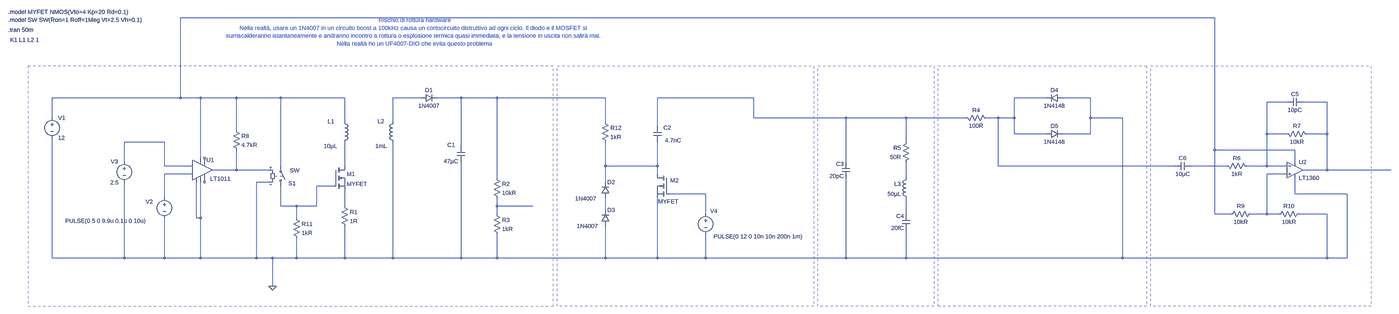
[diagram p0: schematic Eco.asc, whole sheet]
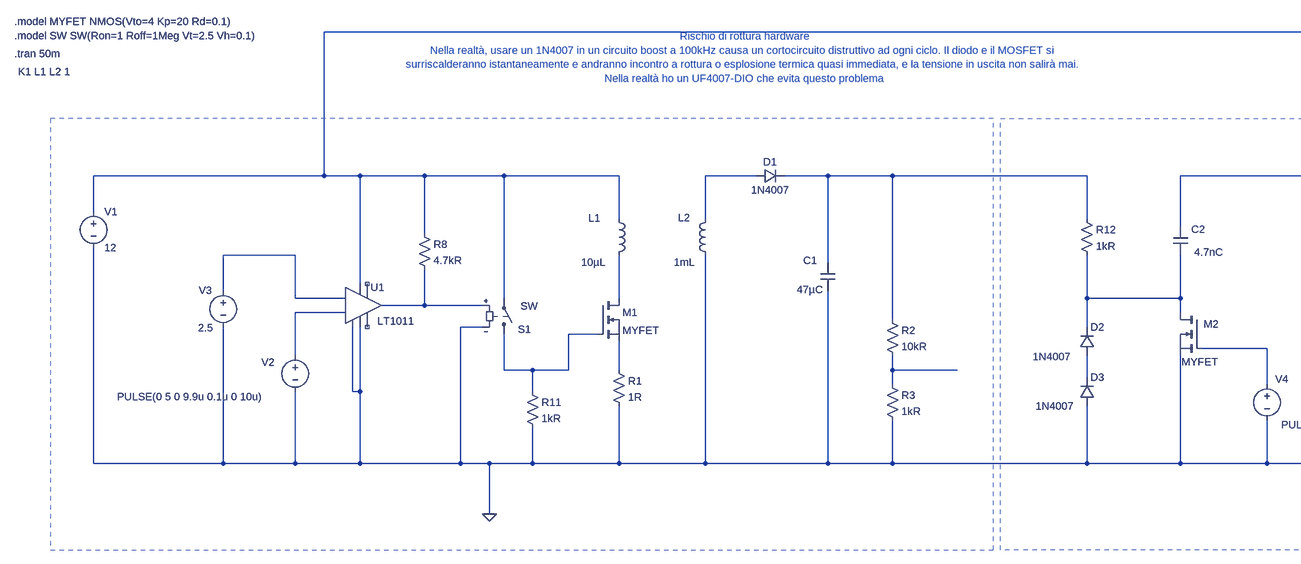
[diagram p1: schematic Eco.asc, part, row 1 of 1, column 1 of 2]
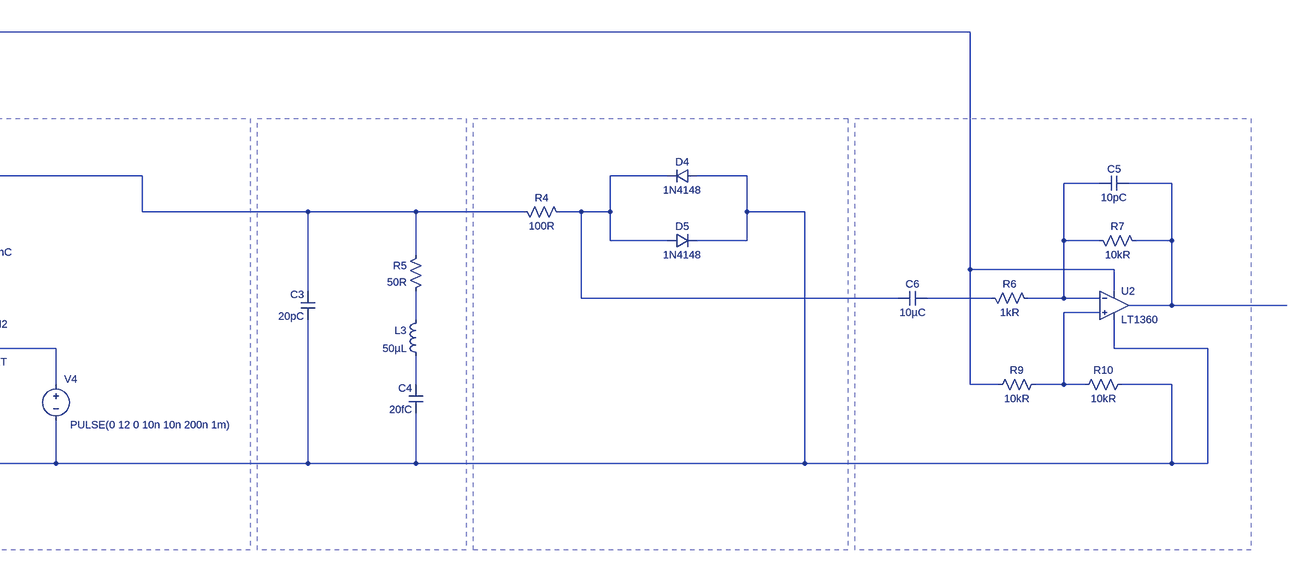
[diagram p2: schematic Eco.asc, part, row 1 of 1, column 2 of 2]
Eco.asc, the LTspice schematic file:
Version 4.1
SHEET 1 5236 1008
WIRE 4160 -816 32 -816
WIRE 32 -496 32 -816
WIRE 32 -496 -480 -496
WIRE 112 -496 32 -496
WIRE 256 -496 112 -496
WIRE 432 -496 256 -496
WIRE 688 -496 432 -496
WIRE 992 -496 880 -496
WIRE 1152 -496 1056 -496
WIRE 1296 -496 1152 -496
WIRE 1728 -496 1296 -496
WIRE 2320 -496 1936 -496
WIRE 3488 -496 3360 -496
WIRE 3664 -496 3552 -496
WIRE 4448 -480 4368 -480
WIRE 4608 -480 4512 -480
WIRE -480 -416 -480 -496
WIRE 2320 -416 2320 -496
WIRE 2688 -416 2320 -416
WIRE 2928 -416 2688 -416
WIRE 3168 -416 2928 -416
WIRE 3296 -416 3248 -416
WIRE 3360 -416 3360 -496
WIRE 3360 -416 3296 -416
WIRE 3664 -416 3664 -496
WIRE 3792 -416 3664 -416
WIRE 688 -400 688 -496
WIRE 880 -400 880 -496
WIRE 1728 -400 1728 -496
WIRE 1936 -384 1936 -496
WIRE 256 -368 256 -496
WIRE 3360 -352 3360 -416
WIRE 3488 -352 3360 -352
WIRE 3664 -352 3664 -416
WIRE 3664 -352 3552 -352
WIRE 4368 -352 4368 -480
WIRE 4448 -352 4368 -352
WIRE 4608 -352 4608 -480
WIRE 4608 -352 4528 -352
WIRE -32 -320 -192 -320
WIRE 2928 -320 2928 -416
WIRE 1152 -304 1152 -496
WIRE 4160 -288 4160 -816
WIRE 4480 -288 4160 -288
WIRE 112 -256 112 -496
WIRE -192 -240 -192 -320
WIRE 2688 -240 2688 -416
WIRE 4480 -240 4480 -288
WIRE -32 -224 -32 -320
WIRE 80 -224 -32 -224
WIRE 432 -224 432 -496
WIRE 688 -224 688 -320
WIRE 1728 -224 1728 -320
WIRE 1936 -224 1936 -320
WIRE 1936 -224 1728 -224
WIRE 3296 -224 3296 -416
WIRE 4000 -224 3296 -224
WIRE 4208 -224 4064 -224
WIRE 4368 -224 4368 -352
WIRE 4368 -224 4288 -224
WIRE 4448 -224 4368 -224
WIRE 256 -208 256 -288
WIRE 256 -208 160 -208
WIRE 384 -208 256 -208
WIRE 4608 -208 4608 -352
WIRE 4608 -208 4512 -208
WIRE 4864 -208 4608 -208
WIRE 80 -192 -32 -192
WIRE 1936 -192 1936 -224
WIRE 4448 -192 4368 -192
WIRE 1296 -176 1296 -496
WIRE 2928 -176 2928 -240
WIRE 384 -160 336 -160
WIRE 1728 -160 1728 -224
WIRE 640 -144 576 -144
WIRE 2128 -112 1984 -112
WIRE 4480 -112 4480 -176
WIRE 4688 -112 4480 -112
WIRE -32 -96 -32 -192
WIRE 432 -64 432 -144
WIRE 496 -64 432 -64
WIRE 576 -64 576 -144
WIRE 576 -64 496 -64
WIRE 688 -64 688 -128
WIRE 1296 -64 1296 -96
WIRE 1440 -64 1296 -64
WIRE 1728 -48 1728 -96
WIRE 1296 -32 1296 -64
WIRE 2128 -32 2128 -112
WIRE 2928 -32 2928 -96
WIRE 4160 -32 4160 -288
WIRE 4224 -32 4160 -32
WIRE 4368 -32 4368 -192
WIRE 4368 -32 4304 -32
WIRE 4416 -32 4368 -32
WIRE 4608 -32 4496 -32
WIRE 96 -16 96 -160
WIRE 112 -16 112 -160
WIRE 112 -16 96 -16
WIRE 496 -16 496 -64
WIRE -480 144 -480 -336
WIRE -192 144 -192 -160
WIRE -192 144 -480 144
WIRE -32 144 -32 -16
WIRE -32 144 -192 144
WIRE 112 144 112 -16
WIRE 112 144 -32 144
WIRE 336 144 336 -160
WIRE 336 144 112 144
WIRE 400 144 336 144
WIRE 496 144 496 64
WIRE 496 144 400 144
WIRE 688 144 688 16
WIRE 688 144 496 144
WIRE 880 144 880 -320
WIRE 880 144 688 144
WIRE 1152 144 1152 -240
WIRE 1152 144 880 144
WIRE 1296 144 1296 48
WIRE 1296 144 1152 144
WIRE 1728 144 1728 16
WIRE 1728 144 1296 144
WIRE 1936 144 1936 -96
WIRE 1936 144 1728 144
WIRE 2128 144 2128 48
WIRE 2128 144 1936 144
WIRE 2688 144 2688 -176
WIRE 2688 144 2128 144
WIRE 2928 144 2928 32
WIRE 2928 144 2688 144
WIRE 3792 144 3792 -416
WIRE 3792 144 2928 144
WIRE 4608 144 4608 -32
WIRE 4608 144 3792 144
WIRE 4688 144 4688 -112
WIRE 4688 144 4608 144
WIRE 400 256 400 144
FLAG 400 256 0
SYMBOL voltage -480 -432 R0
WINDOW 123 0 0 Left 0
WINDOW 39 0 0 Left 0
SYMATTR InstName V1
SYMATTR Value 12
SYMBOL voltage -32 -112 R0
WINDOW 123 0 0 Left 0
WINDOW 39 0 0 Left 0
WINDOW 3 -396 107 Left 2
WINDOW 0 -75 31 Left 2
SYMATTR Value PULSE(0 5 0 9.9u 0.1u 0 10u)
SYMATTR InstName V2
SYMBOL voltage -192 -256 R0
WINDOW 123 0 0 Left 0
WINDOW 39 0 0 Left 0
WINDOW 0 -54 15 Left 2
WINDOW 3 -56 98 Left 2
SYMATTR InstName V3
SYMATTR Value 2.5
SYMBOL Comparators\\LT1011 112 -208 R0
WINDOW 3 39 35 Left 2
SYMATTR InstName U1
SYMBOL nmos 640 -224 R0
SYMATTR InstName M1
SYMATTR Value MYFET
SYMBOL ind 672 -416 R0
WINDOW 0 -52 14 Left 2
WINDOW 3 -68 112 Left 2
SYMATTR InstName L1
SYMATTR Value 10µL
SYMATTR SpiceLine Rser=1m
SYMATTR Type ind
SYMBOL ind 896 -416 M0
WINDOW 0 50 13 Left 2
WINDOW 3 39 112 Left 2
SYMATTR InstName L2
SYMATTR Value 1mL
SYMATTR SpiceLine Rser=1m
SYMATTR Type ind
SYMBOL diode 992 -480 R270
WINDOW 0 32 32 VTop 2
WINDOW 3 0 32 VBottom 2
SYMATTR InstName D1
SYMATTR Value 1N4007
SYMBOL cap 1136 -304 R0
WINDOW 0 -39 -4 Left 2
WINDOW 3 -53 61 Left 2
SYMATTR InstName C1
SYMATTR Value 47µC
SYMBOL res 672 -80 R0
SYMATTR InstName R1
SYMATTR Value 1R
SYMBOL res 1280 -192 R0
SYMATTR InstName R2
SYMATTR Value 10kR
SYMBOL res 1280 -48 R0
SYMATTR InstName R3
SYMATTR Value 1kR
SYMBOL voltage 2128 -48 M0
WINDOW 123 0 0 Left 0
WINDOW 39 0 0 Left 0
WINDOW 3 -390 106 Left 2
WINDOW 0 -48 4 Left 2
SYMATTR Value PULSE(0 12 0 10n 10n 200n 1m)
SYMATTR InstName V4
SYMBOL nmos 1984 -192 M0
WINDOW 0 -37 26 Left 2
WINDOW 3 -36 110 Left 2
SYMATTR InstName M2
SYMATTR Value MYFET
SYMBOL cap 1952 -384 M0
WINDOW 0 -39 7 Left 2
WINDOW 3 -79 58 Left 2
SYMATTR InstName C2
SYMATTR Value 4.7nC
SYMBOL diode 1712 -96 M180
WINDOW 0 24 64 Left 2
WINDOW 3 -105 -2 Left 2
SYMATTR InstName D2
SYMATTR Value 1N4007
SYMBOL diode 1712 16 M180
WINDOW 0 24 64 Left 2
WINDOW 3 -98 0 Left 2
SYMATTR InstName D3
SYMATTR Value 1N4007
SYMBOL diode 3552 -512 R90
WINDOW 0 0 32 VBottom 2
WINDOW 3 32 32 VTop 2
SYMATTR InstName D4
SYMATTR Value 1N4148
SYMBOL diode 3488 -368 M90
WINDOW 0 0 32 VBottom 2
WINDOW 3 32 32 VTop 2
SYMATTR InstName D5
SYMATTR Value 1N4148
SYMBOL res 3152 -432 M90
WINDOW 0 0 56 VBottom 2
WINDOW 3 32 56 VTop 2
SYMATTR InstName R4
SYMATTR Value 100R
SYMBOL cap 2704 -240 M0
SYMATTR InstName C3
SYMATTR Value 20pC
SYMBOL cap 2944 -32 M0
SYMATTR InstName C4
SYMATTR Value 20fC
SYMBOL res 2944 -336 M0
SYMATTR InstName R5
SYMATTR Value 50R
SYMBOL ind 2944 -192 M0
SYMATTR InstName L3
SYMATTR Value 50µL
SYMATTR SpiceLine Rser=1m
SYMBOL res 4304 -208 M270
WINDOW 0 32 56 VTop 2
WINDOW 3 0 56 VBottom 2
SYMATTR InstName R6
SYMATTR Value 1kR
SYMBOL res 4432 -368 M90
WINDOW 0 0 56 VBottom 2
WINDOW 3 32 56 VTop 2
SYMATTR InstName R7
SYMATTR Value 10kR
SYMBOL cap 4448 -496 M90
WINDOW 0 0 32 VBottom 2
WINDOW 3 32 32 VTop 2
SYMATTR InstName C5
SYMATTR Value 10pC
SYMBOL sw 432 -128 M180
WINDOW 0 31 27 Left 2
WINDOW 3 37 78 Left 2
SYMATTR InstName S1
SYMBOL res 240 -384 R0
SYMATTR InstName R8
SYMATTR Value 4.7kR
SYMBOL OpAmps\\LT1360 4480 -208 R0
SYMATTR InstName U2
SYMBOL res 4320 -48 R90
WINDOW 0 0 56 VBottom 2
WINDOW 3 32 56 VTop 2
SYMATTR InstName R9
SYMATTR Value 10kR
SYMBOL res 4512 -48 R90
WINDOW 0 0 56 VBottom 2
WINDOW 3 32 56 VTop 2
SYMATTR InstName R10
SYMATTR Value 10kR
SYMBOL res 480 -32 R0
SYMATTR InstName R11
SYMATTR Value 1kR
SYMBOL res 1712 -416 R0
SYMATTR InstName R12
SYMATTR Value 1kR
SYMBOL cap 4064 -240 R90
WINDOW 0 0 32 VBottom 2
WINDOW 3 32 32 VTop 2
SYMATTR InstName C6
SYMATTR Value 10µC
TEXT -656 -840 Left 2 !.model MYFET NMOS(Vto=4 Kp=20 Rd=0.1)
TEXT -656 -808 Left 2 !.model SW SW(Ron=1 Roff=1Meg Vt=2.5 Vh=0.1)
TEXT -656 -768 Left 2 !.tran 50m
TEXT -648 -728 Left 2 !K1 L1 L2 1
TEXT 968 -760 Center 2 ;Rischio di rottura hardware\nNella realtà, usare un 1N4007 in un circuito boost a 100kHz causa un cortocircuito distruttivo ad ogni ciclo. Il diodo e il MOSFET si \nsurriscalderanno istantaneamente e andranno incontro a rottura o esplosione termica quasi immediata, e la tensione in uscita non salirà mai.\nNella realtà ho un UF4007-DIO che evita questo problema
RECTANGLE Normal -576 336 1520 -624 2
RECTANGLE Normal 2560 336 1536 -624 2
RECTANGLE Normal 3040 336 2576 -624 2
RECTANGLE Normal 3888 336 3056 -624 2
RECTANGLE Normal 4784 336 3904 -624 2

The netlist it stands for:
* Eco.asc
V1 N001 0 12
V2 N013 0 PULSE(0 5 0 9.9u 0.1u 0 10u)
V3 N008 0 2.5
X§U1 0 N013 N008 0 NC_01 NC_02 N012 N001 LT1011
M1 N009 N016 N018 N018 MYFET
L1 N001 N009 10µL Rser=1m
L2 N002 0 1mL Rser=1m
D1 N002 N003 1N4007
C1 N003 0 47µC
R1 N018 0 1R
R2 N003 N019 10kR
R3 N019 0 1kR
V4 N017 0 PULSE(0 12 0 10n 10n 200n 1m)
M2 N010 N017 0 0 MYFET
C2 N004 N010 4.7nC
D2 N020 N010 1N4007
D3 0 N020 1N4007
D4 0 N005 1N4148
D5 N005 0 1N4148
R4 N004 N005 100R
C3 N004 0 20pC
C4 N021 0 20fC
R5 N004 N015 50R
L3 N015 N021 50µL Rser=1m
R6 N006 N011 1kR
R7 N006 N007 10kR
C5 N006 N007 10pC
S1 N016 N001 N012 0 SW
R8 N001 N012 4.7kR
* U2: LT1360 (symbol OpAmps\LT1360 not available, pins judged from their places): In+=N014 In-=N006 V+=N001 V-=0 OUT=N007
R9 N014 N001 10kR
R10 0 N014 10kR
R11 N016 0 1kR
R12 N003 N010 1kR
C6 N011 N005 10µC
.model D D
.lib standard.dio
.model NMOS NMOS
.model PMOS PMOS
.lib standard.mos
.model MYFET NMOS(Vto=4 Kp=20 Rd=0.1)
.model SW SW(Ron=1 Roff=1Meg Vt=2.5 Vh=0.1)
.tran 50m
K1 L1 L2 1
* Rischio di rottura hardware
* Nella realtà, usare un 1N4007 in un circuito boost a 100kHz causa un cortocircuito distruttivo ad ogni ciclo. Il diodo e il MOSFET si
* surriscalderanno istantaneamente e andranno incontro a rottura o esplosione termica quasi immediata, e la tensione in uscita non salirà mai.
* Nella realtà ho un UF4007-DIO che evita questo problema
.lib LTC1.lib
.backanno
.end